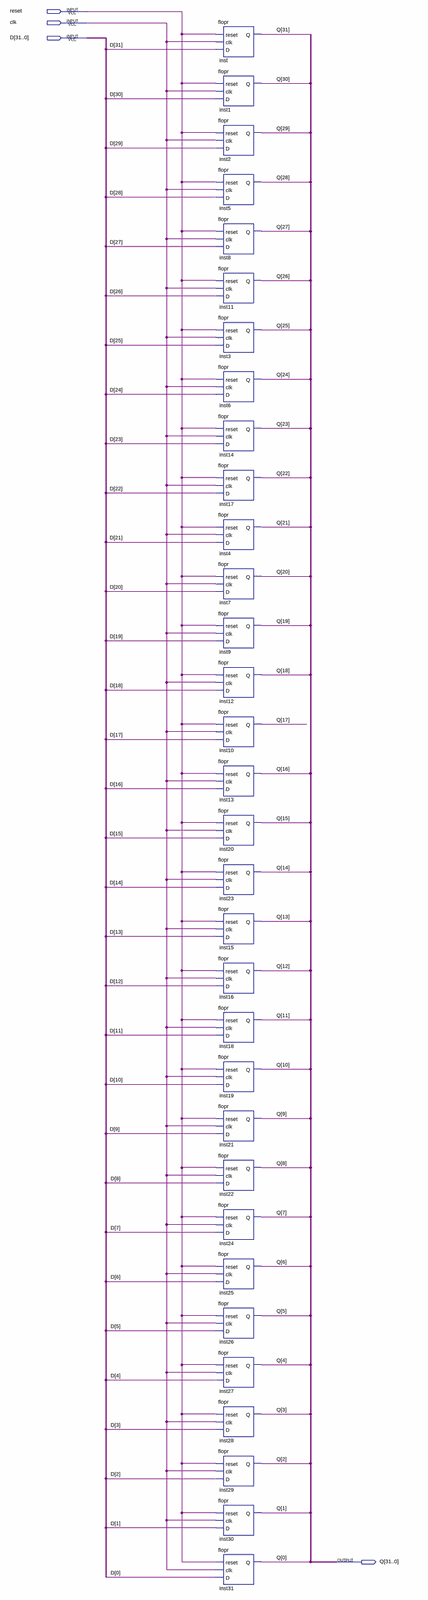
[diagram p0: schematic sheet, whole]
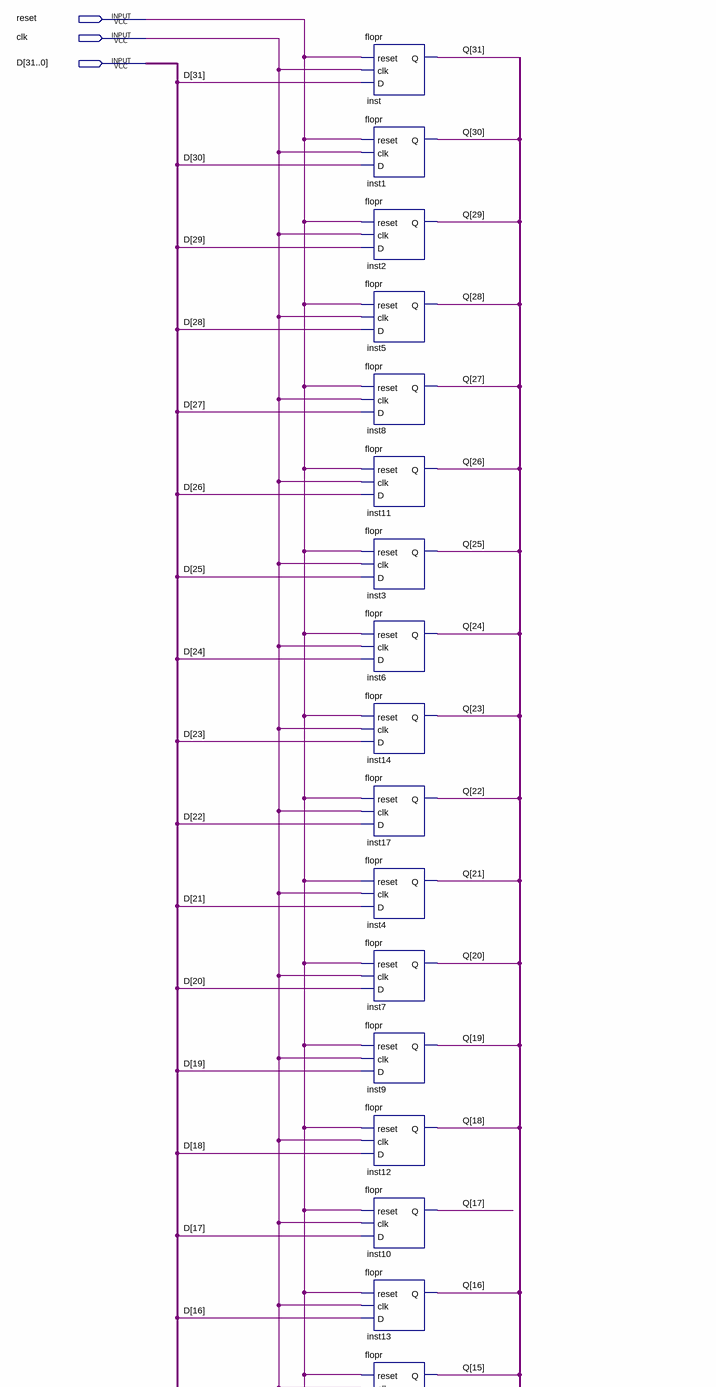
[diagram p1: schematic sheet, upper part]
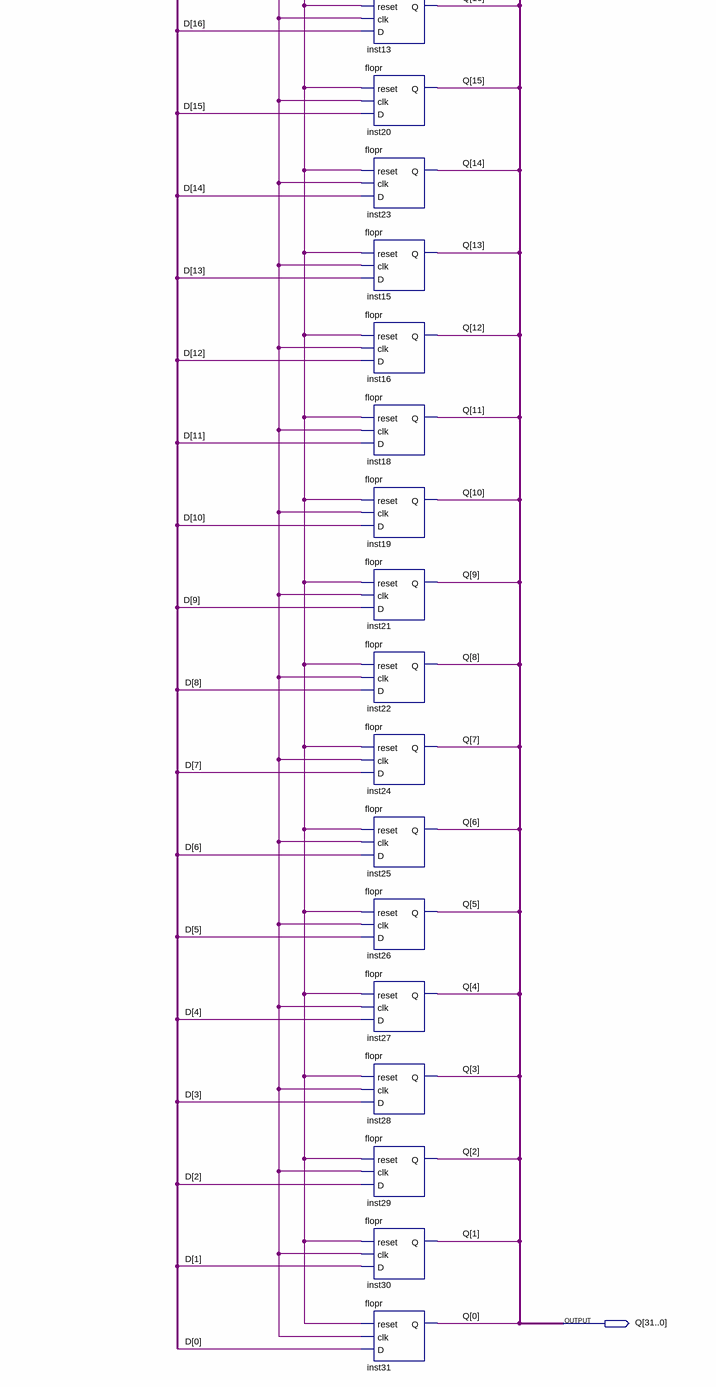
[diagram p2: schematic sheet, lower part]
// Quartus schematic flopr_32.bdf as structural Verilog: 32 symbols, 4 pins
module flopr_32 (
  input  reset,
  input  clk,
  input  [31:0] D,
  output [31:0] Q
);

  flopr inst (.reset(reset), .clk(clk), .D(D[31]), .Q(Q[31]));
  flopr inst1 (.reset(reset), .clk(clk), .D(D[30]), .Q(Q[30]));
  flopr inst2 (.reset(reset), .clk(clk), .D(D[29]), .Q(Q[29]));
  flopr inst5 (.reset(reset), .clk(clk), .D(D[28]), .Q(Q[28]));
  flopr inst8 (.reset(reset), .clk(clk), .D(D[27]), .Q(Q[27]));
  flopr inst11 (.reset(reset), .clk(clk), .D(D[26]), .Q(Q[26]));
  flopr inst3 (.reset(reset), .clk(clk), .D(D[25]), .Q(Q[25]));
  flopr inst6 (.reset(reset), .clk(clk), .D(D[24]), .Q(Q[24]));
  flopr inst14 (.reset(reset), .clk(clk), .D(D[23]), .Q(Q[23]));
  flopr inst17 (.reset(reset), .clk(clk), .D(D[22]), .Q(Q[22]));
  flopr inst4 (.reset(reset), .clk(clk), .D(D[21]), .Q(Q[21]));
  flopr inst7 (.reset(reset), .clk(clk), .D(D[20]), .Q(Q[20]));
  flopr inst9 (.reset(reset), .clk(clk), .D(D[19]), .Q(Q[19]));
  flopr inst12 (.reset(reset), .clk(clk), .D(D[18]), .Q(Q[18]));
  flopr inst10 (.reset(reset), .clk(clk), .D(D[17]), .Q(Q[17]));
  flopr inst13 (.reset(reset), .clk(clk), .D(D[16]), .Q(Q[16]));
  flopr inst20 (.reset(reset), .clk(clk), .D(D[15]), .Q(Q[15]));
  flopr inst23 (.reset(reset), .clk(clk), .D(D[14]), .Q(Q[14]));
  flopr inst15 (.reset(reset), .clk(clk), .D(D[13]), .Q(Q[13]));
  flopr inst16 (.reset(reset), .clk(clk), .D(D[12]), .Q(Q[12]));
  flopr inst18 (.reset(reset), .clk(clk), .D(D[11]), .Q(Q[11]));
  flopr inst19 (.reset(reset), .clk(clk), .D(D[10]), .Q(Q[10]));
  flopr inst21 (.reset(reset), .clk(clk), .D(D[9]), .Q(Q[9]));
  flopr inst22 (.reset(reset), .clk(clk), .D(D[8]), .Q(Q[8]));
  flopr inst24 (.reset(reset), .clk(clk), .D(D[7]), .Q(Q[7]));
  flopr inst25 (.reset(reset), .clk(clk), .D(D[6]), .Q(Q[6]));
  flopr inst26 (.reset(reset), .clk(clk), .D(D[5]), .Q(Q[5]));
  flopr inst27 (.reset(reset), .clk(clk), .D(D[4]), .Q(Q[4]));
  flopr inst28 (.reset(reset), .clk(clk), .D(D[3]), .Q(Q[3]));
  flopr inst29 (.reset(reset), .clk(clk), .D(D[2]), .Q(Q[2]));
  flopr inst30 (.reset(reset), .clk(clk), .D(D[1]), .Q(Q[1]));
  flopr inst31 (.reset(reset), .clk(clk), .D(D[0]), .Q(Q[0]));
endmodule
